# Altium schematic sheet Sheet1.SchDoc
size A
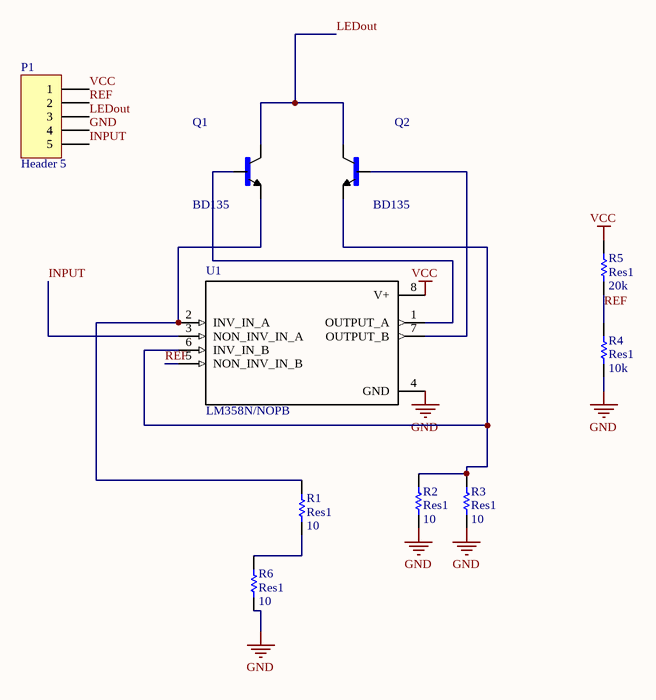
[diagram p0: Sheet1.SchDoc]

## Parts
P1  Header 5  [HDR1X5]
Q1  BD135  [*TO229P780X300X2000-3]
Q2  BD135  [*TO229P780X300X2000-3]
R1  Res1  value 10  [AXIAL-0.3]
R2  Res1  value 10  [AXIAL-0.3]
R3  Res1  value 10  [AXIAL-0.3]
R4  Res1  value 10k  [AXIAL-0.3]
R5  Res1  value 20k  [AXIAL-0.3]
R6  Res1  value 10  [AXIAL-0.3]
U1  LM358N/NOPB  [*DIP794W45P254L1016H508Q8]

## Nets
GND: P1.4 R2.1 R3.1 R4.1 R6.1 U1.4(GND)
VCC: P1.1 R5.2 U1.8(V+)
INPUT: P1.5 U1.3(NON_INV_IN_A)
LEDout: P1.3 Q1.2(C) Q2.2(C)
REF: P1.2 R4.2 R5.1 U1.5(NON_INV_IN_B)
NetQ1_1: Q1.1(E) R1.2 U1.2(INV_IN_A)
NetQ1_3: Q1.3(B) U1.1(OUTPUT_A)
NetQ2_1: Q2.1(E) R2.2 R3.2 U1.6(INV_IN_B)
NetQ2_3: Q2.3(B) U1.7(OUTPUT_B)
NetR1_1: R1.1 R6.2

## Library data of the parts
P1 = Header 5: Header, 5-Pin; LatestRevisionDate: 17-Jul-2002; LatestRevisionNote: Re-released for DXP Platform.; Publisher: Altium Limited
Q1 Q2 = BD135: Trans GP BJT NPN 45V 1.5A 3-Pin TO-126; MF: ON Semiconductor; Price: None; Package: TO-126-3 NXP Semiconductors; MP: BD135; SnapEDA_Link: https://www.snapeda.com/parts/BD135/ON%20Semiconductor/view-part/?ref=snap; Availability: Unavailable; Value: *
R1-R6 = Res1: Resistor; Published: 8-Jun-2000; LatestRevisionDate: 17-Jul-2002; LatestRevisionNote: Re-released for DXP Platform.; PackageReference: AXIAL-0.3; Publisher: Altium Limited; PackageDescription: Axial Device, Thru-Hole; 2 Leads; 0.3 in Pin Spacing
U1 = LM358N/NOPB: MF: ON Semiconductor; MP: LM358N; Price: None; Package: DIP-8 Intersil; SnapEDA_Link: https://www.snapeda.com/parts/LM358N/ON%20Semiconductor/view-part/?ref=snap; Availability: Unavailable; Value: *